# EAGLE schematic board (EAGLE 8.3.1)
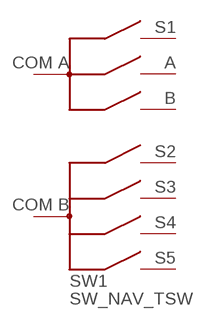
[diagram p0: schematic, sheet 1]

## Parts
SW1  SW_NAV_TSW  [TSWB3NCB111LFS]
Unconnected: SW1.A SW1.B SW1.COMA(COM_A) SW1.COMB(COM_B) SW1.S1 SW1.S2 SW1.S3 SW1.S4 SW1.S5

## Library data of the parts
SW1 = we-switch:SW_NAV_TSW: C&K TSWB-3N-CB111-LFS central select with jog and 4 directions (dial & direction ring) white - TSWB-3N-CB111 LFS black - TSWB-3N-CB222 LFS